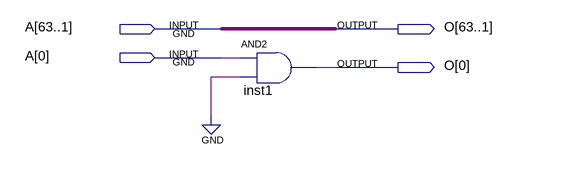
[diagram p0: schematic sheet]
// Quartus schematic set_bit_0.bdf as structural Verilog: 1 symbols, 4 pins
module set_bit_0 (
  input  [63:0] A,
  output [63:0] O
);

  and inst1 (O[0], A[0], 1'b0);

  assign O[63:1] = A[63:1];
endmodule
